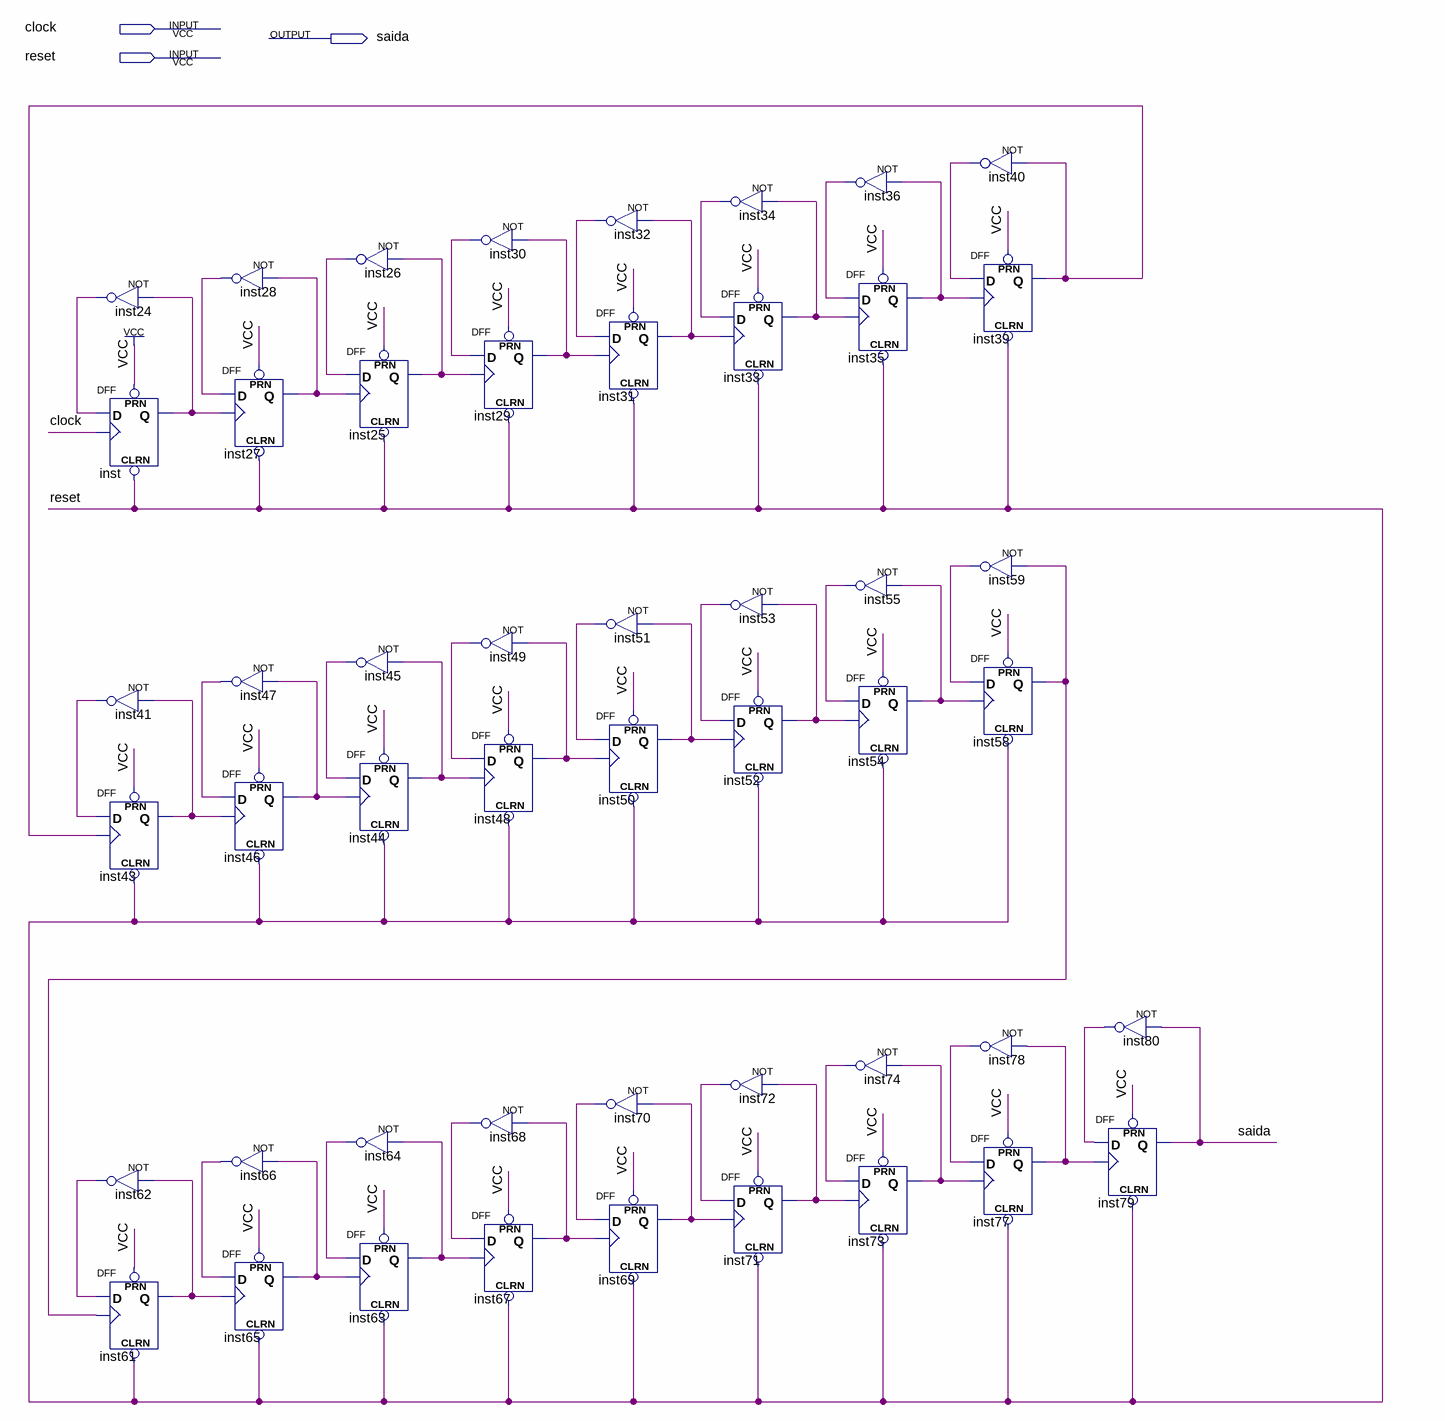
[diagram p0: schematic sheet]
// Quartus schematic divFreq.bdf as structural Verilog: 50 symbols, 3 pins
module divFreq (
  input  clock,
  input  reset,
  output saida
);

  wire inst24_out, inst25_q, inst26_out, inst27_q, inst28_out, inst29_q, inst30_out, inst31_q, inst32_out,
       inst33_q, inst34_out, inst35_q, inst36_out, inst39_q, inst40_out, inst41_out, inst43_q, inst44_q,
       inst45_out, inst46_q, inst47_out, inst48_q, inst49_out, inst50_q, inst51_out, inst52_q, inst53_out,
       inst54_q, inst55_out, inst58_q, inst59_out, inst61_q, inst62_out, inst63_q, inst64_out, inst65_q,
       inst66_out, inst67_q, inst68_out, inst69_q, inst70_out, inst71_q, inst72_out, inst73_q, inst74_out,
       inst77_q, inst78_out, inst80_out, inst_q;

  not inst24 (inst24_out, inst_q);
  DFF inst (.CLRN(reset), .CLK(clock), .D(inst24_out), .PRN(1'b1), .Q(inst_q));
  not inst41 (inst41_out, inst43_q);
  DFF inst43 (.CLRN(reset), .CLK(inst39_q), .D(inst41_out), .PRN(1'b1), .Q(inst43_q));
  not inst62 (inst62_out, inst61_q);
  DFF inst61 (.CLRN(reset), .CLK(inst58_q), .D(inst62_out), .PRN(1'b1), .Q(inst61_q));
  not inst28 (inst28_out, inst27_q);
  DFF inst27 (.CLRN(reset), .CLK(inst_q), .D(inst28_out), .PRN(1'b1), .Q(inst27_q));
  not inst47 (inst47_out, inst46_q);
  DFF inst46 (.CLRN(reset), .CLK(inst43_q), .D(inst47_out), .PRN(1'b1), .Q(inst46_q));
  not inst66 (inst66_out, inst65_q);
  DFF inst65 (.CLRN(reset), .CLK(inst61_q), .D(inst66_out), .PRN(1'b1), .Q(inst65_q));
  not inst26 (inst26_out, inst25_q);
  DFF inst25 (.CLRN(reset), .CLK(inst27_q), .D(inst26_out), .PRN(1'b1), .Q(inst25_q));
  not inst45 (inst45_out, inst44_q);
  DFF inst44 (.CLRN(reset), .CLK(inst46_q), .D(inst45_out), .PRN(1'b1), .Q(inst44_q));
  not inst64 (inst64_out, inst63_q);
  DFF inst63 (.CLRN(reset), .CLK(inst65_q), .D(inst64_out), .PRN(1'b1), .Q(inst63_q));
  not inst30 (inst30_out, inst29_q);
  DFF inst29 (.CLRN(reset), .CLK(inst25_q), .D(inst30_out), .PRN(1'b1), .Q(inst29_q));
  not inst49 (inst49_out, inst48_q);
  DFF inst48 (.CLRN(reset), .CLK(inst44_q), .D(inst49_out), .PRN(1'b1), .Q(inst48_q));
  not inst68 (inst68_out, inst67_q);
  DFF inst67 (.CLRN(reset), .CLK(inst63_q), .D(inst68_out), .PRN(1'b1), .Q(inst67_q));
  not inst32 (inst32_out, inst31_q);
  DFF inst31 (.CLRN(reset), .CLK(inst29_q), .D(inst32_out), .PRN(1'b1), .Q(inst31_q));
  not inst51 (inst51_out, inst50_q);
  DFF inst50 (.CLRN(reset), .CLK(inst48_q), .D(inst51_out), .PRN(1'b1), .Q(inst50_q));
  not inst70 (inst70_out, inst69_q);
  DFF inst69 (.CLRN(reset), .CLK(inst67_q), .D(inst70_out), .PRN(1'b1), .Q(inst69_q));
  not inst34 (inst34_out, inst33_q);
  DFF inst33 (.CLRN(reset), .CLK(inst31_q), .D(inst34_out), .PRN(1'b1), .Q(inst33_q));
  not inst53 (inst53_out, inst52_q);
  DFF inst52 (.CLRN(reset), .CLK(inst50_q), .D(inst53_out), .PRN(1'b1), .Q(inst52_q));
  not inst72 (inst72_out, inst71_q);
  DFF inst71 (.CLRN(reset), .CLK(inst69_q), .D(inst72_out), .PRN(1'b1), .Q(inst71_q));
  not inst36 (inst36_out, inst35_q);
  DFF inst35 (.CLRN(reset), .CLK(inst33_q), .D(inst36_out), .PRN(1'b1), .Q(inst35_q));
  not inst55 (inst55_out, inst54_q);
  DFF inst54 (.CLRN(reset), .CLK(inst52_q), .D(inst55_out), .PRN(1'b1), .Q(inst54_q));
  not inst74 (inst74_out, inst73_q);
  DFF inst73 (.CLRN(reset), .CLK(inst71_q), .D(inst74_out), .PRN(1'b1), .Q(inst73_q));
  not inst40 (inst40_out, inst39_q);
  DFF inst39 (.CLRN(reset), .CLK(inst35_q), .D(inst40_out), .PRN(1'b1), .Q(inst39_q));
  not inst59 (inst59_out, inst58_q);
  DFF inst58 (.CLRN(reset), .CLK(inst54_q), .D(inst59_out), .PRN(1'b1), .Q(inst58_q));
  not inst78 (inst78_out, inst77_q);
  DFF inst77 (.CLRN(reset), .CLK(inst73_q), .D(inst78_out), .PRN(1'b1), .Q(inst77_q));
  not inst80 (inst80_out, saida);
  DFF inst79 (.CLRN(reset), .CLK(inst77_q), .D(inst80_out), .PRN(1'b1), .Q(saida));
endmodule
